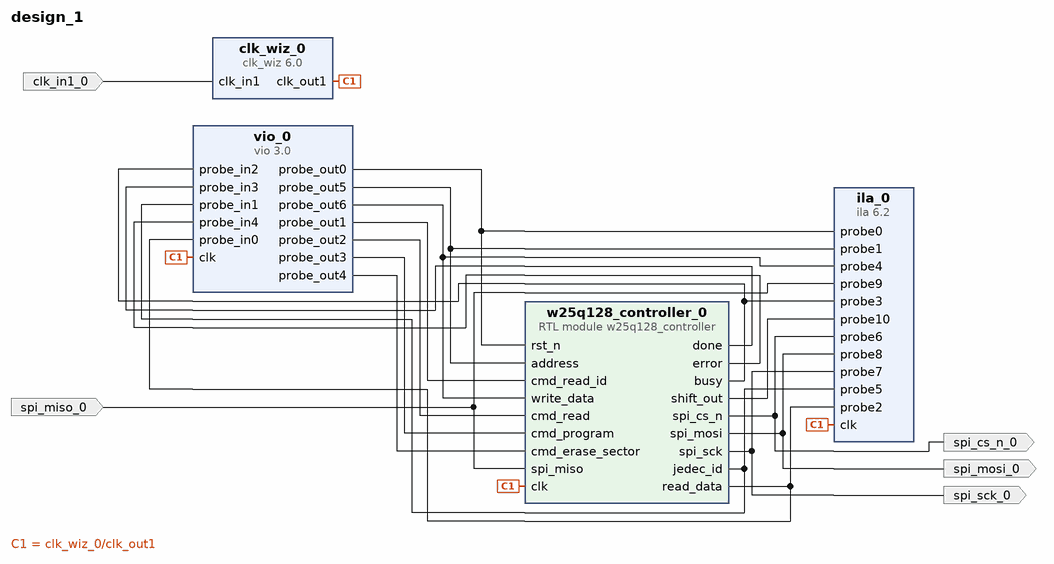
[diagram p0: block diagram of the top level]
# Vivado block design design_1, xc7a50tftg256-1, Vivado 2022.1
create_bd_design design_1

create_bd_port -dir I -type clk clk_in1_0
set_property -dict {CONFIG.FREQ_HZ 200000000} [get_bd_ports clk_in1_0]
create_bd_port -dir O spi_cs_n_0
create_bd_port -dir O spi_sck_0
create_bd_port -dir O spi_mosi_0
create_bd_port -dir I spi_miso_0

create_bd_cell -type ip -vlnv xilinx.com:ip:clk_wiz:6.0 clk_wiz_0
set_property -dict [list \
  CONFIG.CLKIN1_JITTER_PS 50.0 \
  CONFIG.CLKOUT1_JITTER 112.316 \
  CONFIG.CLKOUT1_PHASE_ERROR 89.971 \
  CONFIG.MMCM_CLKFBOUT_MULT_F 5.000 \
  CONFIG.MMCM_CLKIN1_PERIOD 5.000 \
  CONFIG.MMCM_CLKIN2_PERIOD 10.0 \
  CONFIG.PRIM_IN_FREQ 200.000 \
  CONFIG.USE_LOCKED false \
  CONFIG.USE_RESET false \
] [get_bd_cells clk_wiz_0]
create_bd_cell -type ip -vlnv xilinx.com:ip:vio:3.0 vio_0
set_property -dict [list \
  CONFIG.C_NUM_PROBE_IN 5 \
  CONFIG.C_NUM_PROBE_OUT 7 \
  CONFIG.C_PROBE_OUT5_WIDTH 24 \
  CONFIG.C_PROBE_OUT6_WIDTH 8 \
] [get_bd_cells vio_0]
create_bd_cell -type ip -vlnv xilinx.com:ip:ila:6.2 ila_0
set_property -dict [list \
  CONFIG.C_DATA_DEPTH 32768 \
  CONFIG.C_ENABLE_ILA_AXI_MON false \
  CONFIG.C_MONITOR_TYPE Native \
  CONFIG.C_NUM_OF_PROBES 11 \
  CONFIG.C_PROBE10_WIDTH 8 \
  CONFIG.C_PROBE1_WIDTH 24 \
  CONFIG.C_PROBE2_WIDTH 8 \
  CONFIG.C_PROBE4_WIDTH 8 \
  CONFIG.C_PROBE5_WIDTH 24 \
] [get_bd_cells ila_0]
create_bd_cell -type module -reference w25q128_controller w25q128_controller_0

# ---- connections ----

connect_bd_net -net clk_in1_0_1 [get_bd_ports clk_in1_0] [get_bd_pins clk_wiz_0/clk_in1]
connect_bd_net [get_bd_pins clk_wiz_0/clk_out1] [get_bd_pins vio_0/clk] [get_bd_pins ila_0/clk] [get_bd_pins w25q128_controller_0/clk]
connect_bd_net -net spi_miso_0_1 [get_bd_ports spi_miso_0] [get_bd_pins ila_0/probe9] [get_bd_pins w25q128_controller_0/spi_miso]
connect_bd_net [get_bd_pins vio_0/probe_out0] [get_bd_pins ila_0/probe0] [get_bd_pins w25q128_controller_0/rst_n]
connect_bd_net [get_bd_pins vio_0/probe_out1] [get_bd_pins w25q128_controller_0/cmd_read_id]
connect_bd_net [get_bd_pins vio_0/probe_out2] [get_bd_pins w25q128_controller_0/cmd_read]
connect_bd_net [get_bd_pins vio_0/probe_out3] [get_bd_pins w25q128_controller_0/cmd_program]
connect_bd_net [get_bd_pins vio_0/probe_out4] [get_bd_pins w25q128_controller_0/cmd_erase_sector]
connect_bd_net [get_bd_pins vio_0/probe_out5] [get_bd_pins ila_0/probe1] [get_bd_pins w25q128_controller_0/address]
connect_bd_net [get_bd_pins vio_0/probe_out6] [get_bd_pins ila_0/probe4] [get_bd_pins w25q128_controller_0/write_data]
connect_bd_net [get_bd_pins w25q128_controller_0/busy] [get_bd_pins vio_0/probe_in2] [get_bd_pins ila_0/probe3]
connect_bd_net [get_bd_pins w25q128_controller_0/done] [get_bd_pins vio_0/probe_in3]
connect_bd_net [get_bd_pins w25q128_controller_0/error] [get_bd_pins vio_0/probe_in4]
connect_bd_net [get_bd_pins w25q128_controller_0/jedec_id] [get_bd_pins vio_0/probe_in1] [get_bd_pins ila_0/probe5]
connect_bd_net [get_bd_pins w25q128_controller_0/read_data] [get_bd_pins vio_0/probe_in0] [get_bd_pins ila_0/probe2]
connect_bd_net -net w25q128_controller_0_shift [get_bd_pins w25q128_controller_0/shift_out] [get_bd_pins ila_0/probe10]
connect_bd_net [get_bd_pins w25q128_controller_0/spi_cs_n] [get_bd_ports spi_cs_n_0] [get_bd_pins ila_0/probe6]
connect_bd_net [get_bd_pins w25q128_controller_0/spi_mosi] [get_bd_ports spi_mosi_0] [get_bd_pins ila_0/probe8]
connect_bd_net [get_bd_pins w25q128_controller_0/spi_sck] [get_bd_ports spi_sck_0] [get_bd_pins ila_0/probe7]

validate_bd_design
save_bd_design
